# EAGLE schematic CLU (EAGLE 9.6.1)
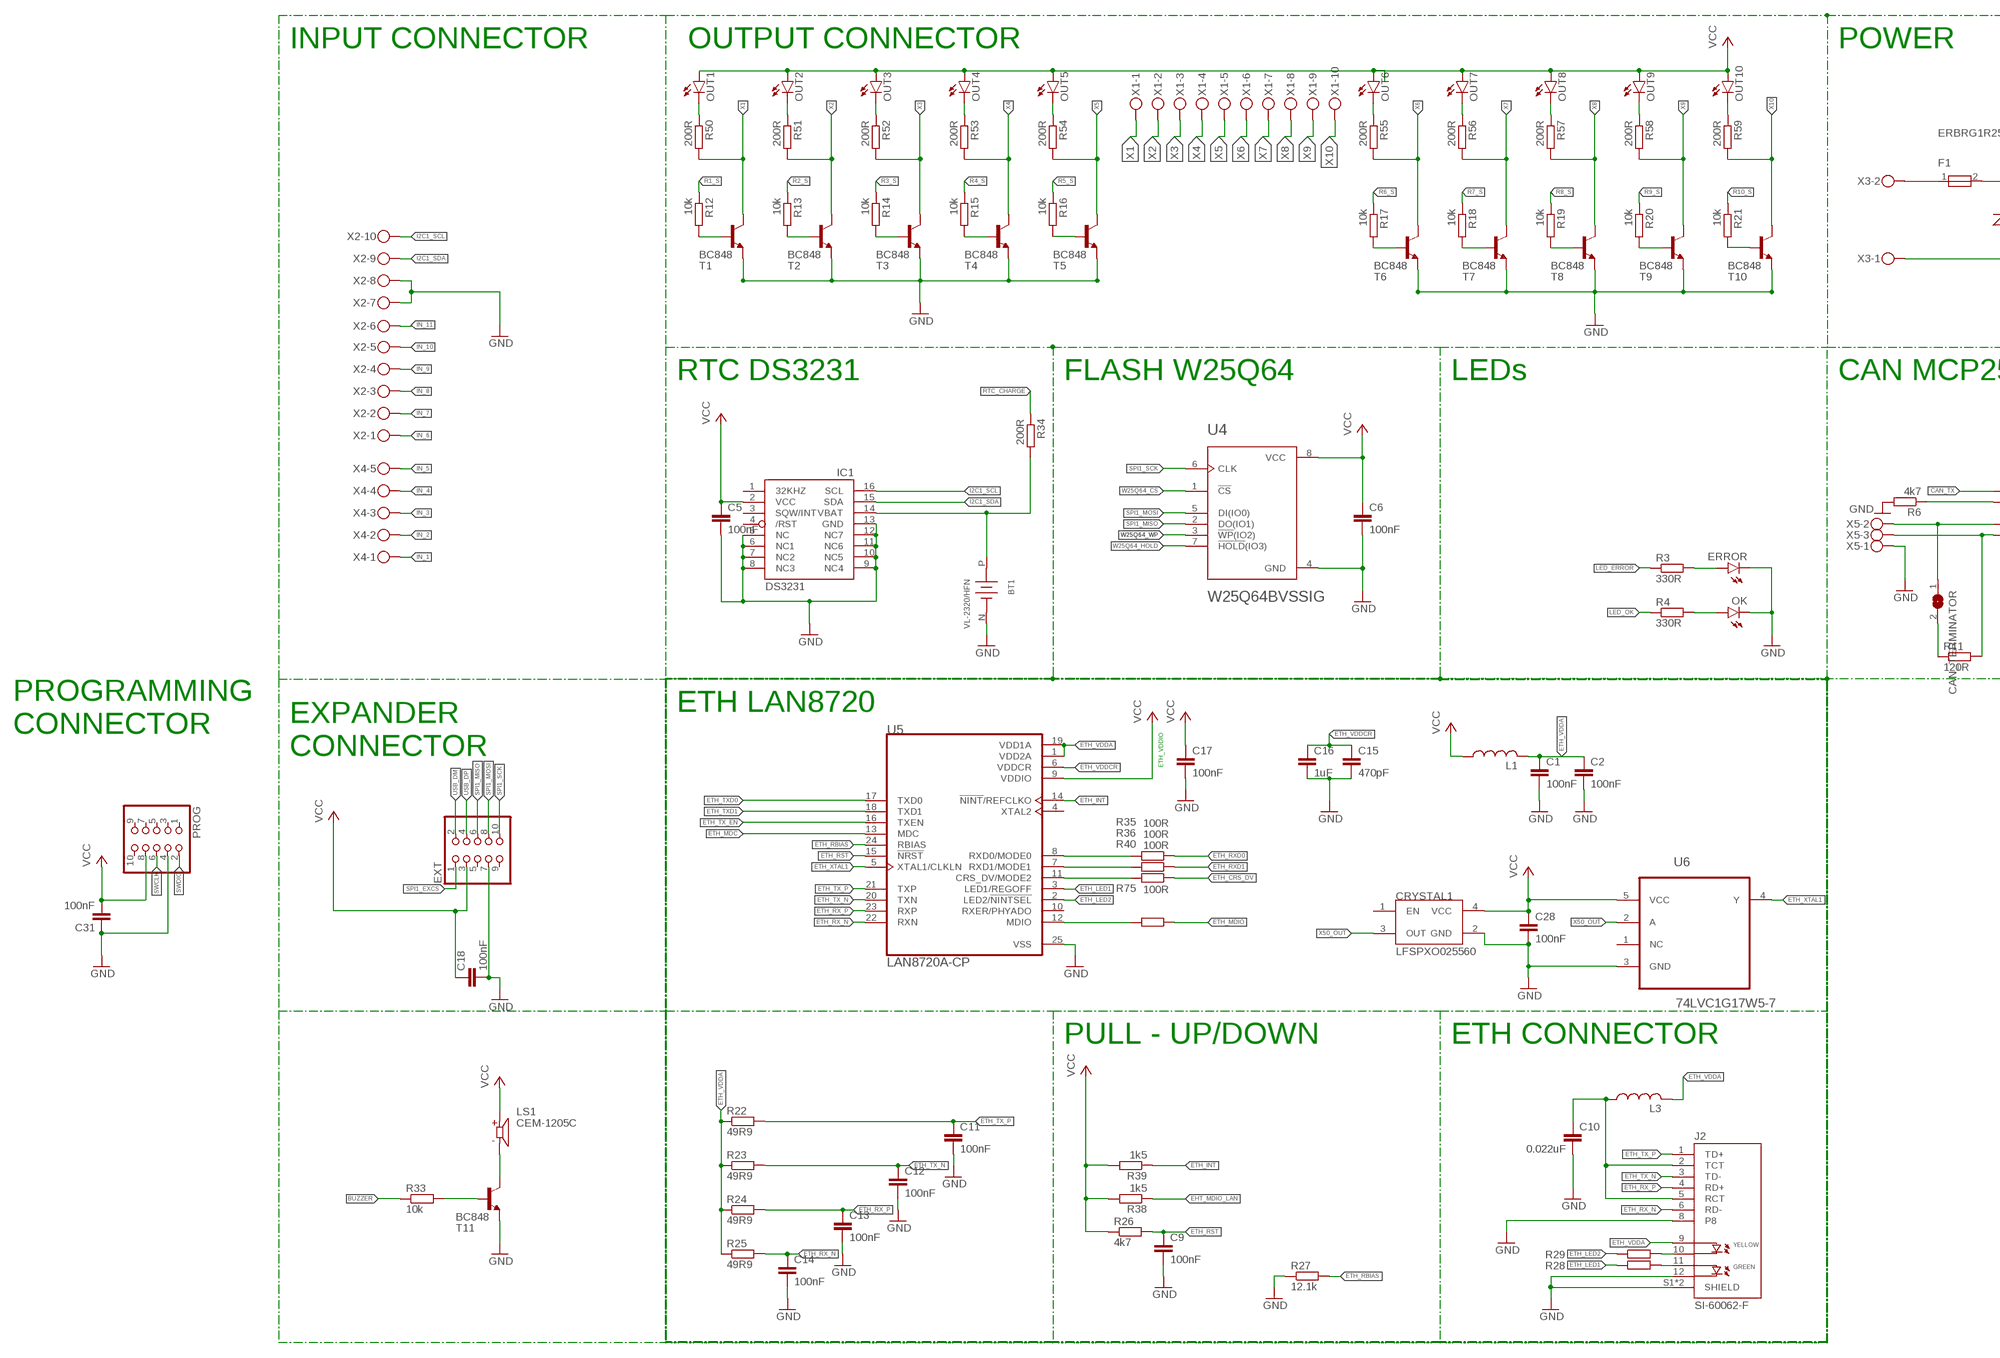
[diagram p0: schematic, sheet 1, part 1 of 2]
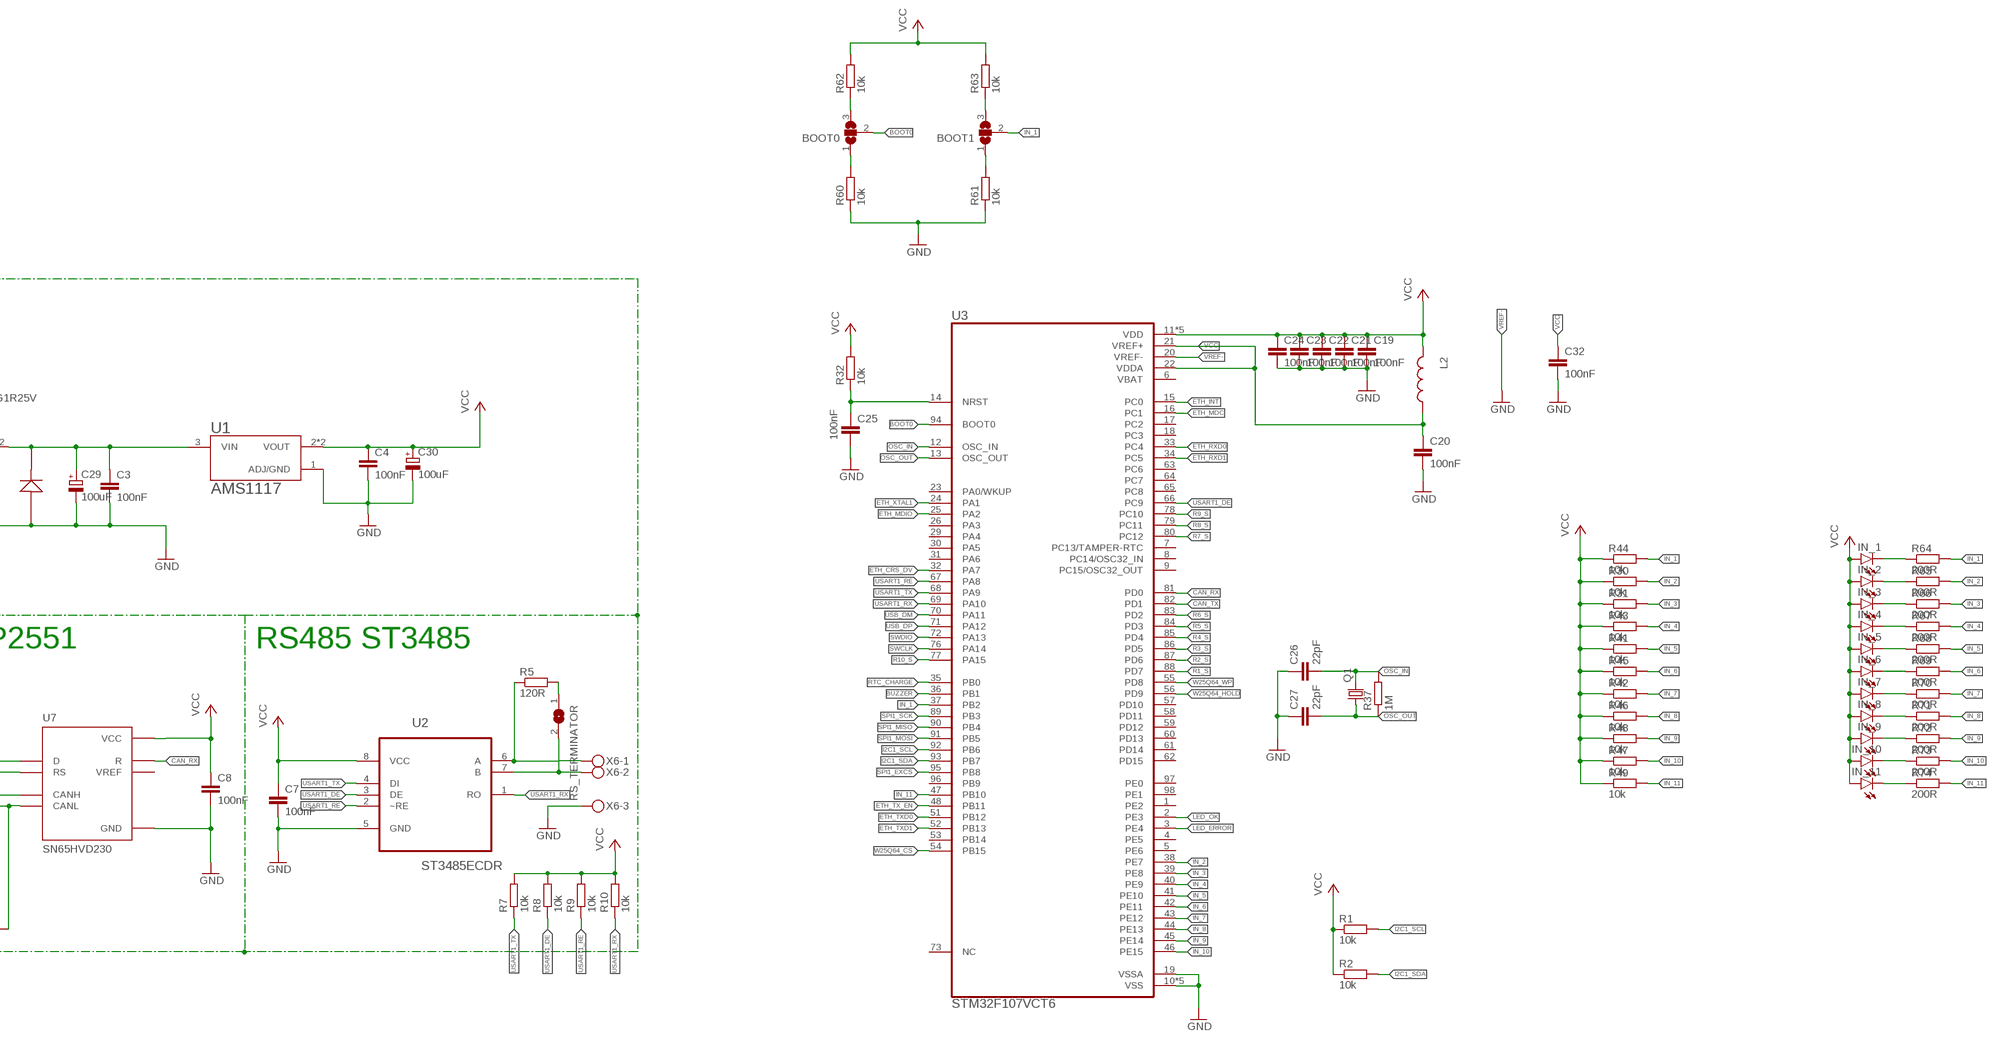
[diagram p1: schematic, sheet 1, part 2 of 2]

## Parts
BOOT0  SJ2W  [SJ_2]
BOOT1  SJ2W  [SJ_2]
BT1  VL-2320/HFN  [BAT_VL-2320/HFN]
C1  100nF  C-EUC0805  [C0805]
C2  100nF  C-EUC0805  [C0805]
C3  100nF  C-EUC0805  [C0805]
C4  100nF  C-EUC0805  [C0805]
C5  100nF  C-EUC0805  [C0805]
C6  100nF  C-EUC0805  [C0805]
C7  100nF  C-EUC0805  [C0805]
C8  100nF  C-EUC0805  [C0805]
C9  100nF  C-EUC0805  [C0805]
C10  0.022uF  C-EUC0805  [C0805]
C11  100nF  C-EUC0805  [C0805]
C12  100nF  C-EUC0805  [C0805]
C13  100nF  C-EUC0805  [C0805]
C14  100nF  C-EUC0805  [C0805]
C15  470pF  C-EUC0805  [C0805]
C16  1uF  C-EUC0805  [C0805]
C17  100nF  C-EUC0805  [C0805]
C18  100nF  C-EUC0805  [C0805]
C19  100nF  C-EUC0805  [C0805]
C20  100nF  C-EUC0805  [C0805]
C21  100nF  C-EUC0805  [C0805]
C22  100nF  C-EUC0805  [C0805]
C23  100nF  C-EUC0805  [C0805]
C24  100nF  C-EUC0805  [C0805]
C25  100nF  C-EUC0805  [C0805]
C26  22pF  C-EUC0805  [C0805]
C27  22pF  C-EUC0805  [C0805]
C28  100nF  C-EUC0805  [C0805]
C29  100uF  CPOL-EUSANYO_SMD_E7  [SANYO-OSCON_SMD_E7]
C30  100uF  CPOL-EUSANYO_SMD_E7  [SANYO-OSCON_SMD_E7]
C31  100nF  C-EUC0805  [C0805]
C32  100nF  C-EUC0805  [C0805]
CAN_TERMINATOR  SJ  [SJ]
CRYSTAL1  LFSPXO025560  [LFSPXO025560-SMD-4]
D1  BYG10D  [DIO_ES1J]
ERROR  LEDCHIPLED_0805  [CHIPLED_0805]
EXT  PINHD-2X5  [2X05]
F1  ERBRG1R25V  [FUSC1206X75N]
IC1  DS3231/SO  [SO16W]
IN_1  LEDCHIPLED_0805  [CHIPLED_0805]
IN_2  LEDCHIPLED_0805  [CHIPLED_0805]
IN_3  LEDCHIPLED_0805  [CHIPLED_0805]
IN_4  LEDCHIPLED_0805  [CHIPLED_0805]
IN_5  LEDCHIPLED_0805  [CHIPLED_0805]
IN_6  LEDCHIPLED_0805  [CHIPLED_0805]
IN_7  LEDCHIPLED_0805  [CHIPLED_0805]
IN_8  LEDCHIPLED_0805  [CHIPLED_0805]
IN_9  LEDCHIPLED_0805  [CHIPLED_0805]
IN_10  LEDCHIPLED_0805  [CHIPLED_0805]
IN_11  LEDCHIPLED_0805  [CHIPLED_0805]
J2  SI-60062-F  [BEL_SI-60062-F]
L1  L-USL2012C  [L2012C]
L2  L-USL2012C  [L2012C]
L3  L-USL2012C  [L2012C]
LS1  CEM-1205C  [CUI_CEM-1205C]
OK  LEDCHIPLED_0805  [CHIPLED_0805]
OUT1  LEDCHIPLED_0805  [CHIPLED_0805]
OUT2  LEDCHIPLED_0805  [CHIPLED_0805]
OUT3  LEDCHIPLED_0805  [CHIPLED_0805]
OUT4  LEDCHIPLED_0805  [CHIPLED_0805]
OUT5  LEDCHIPLED_0805  [CHIPLED_0805]
OUT6  LEDCHIPLED_0805  [CHIPLED_0805]
OUT7  LEDCHIPLED_0805  [CHIPLED_0805]
OUT8  LEDCHIPLED_0805  [CHIPLED_0805]
OUT9  LEDCHIPLED_0805  [CHIPLED_0805]
OUT10  LEDCHIPLED_0805  [CHIPLED_0805]
PROG  PINHD-2X5  [2X05]
Q1  CRYSTALHC49UP  [HC49UP]
R1  10k  R-EU_R0805  [R0805]
R2  10k  R-EU_R0805  [R0805]
R3  330R  R-EU_R0805  [R0805]
R4  330R  R-EU_R0805  [R0805]
R5  120R  R-EU_R0805  [R0805]
R6  4k7  R-EU_R0805  [R0805]
R7  10k  R-EU_R0805  [R0805]
R8  10k  R-EU_R0805  [R0805]
R9  10k  R-EU_R0805  [R0805]
R10  10k  R-EU_R0805  [R0805]
R11  120R  R-EU_R0805  [R0805]
R12  10k  R-EU_R0805  [R0805]
R13  10k  R-EU_R0805  [R0805]
R14  10k  R-EU_R0805  [R0805]
R15  10k  R-EU_R0805  [R0805]
R16  10k  R-EU_R0805  [R0805]
R17  10k  R-EU_R0805  [R0805]
R18  10k  R-EU_R0805  [R0805]
R19  10k  R-EU_R0805  [R0805]
R20  10k  R-EU_R0805  [R0805]
R21  10k  R-EU_R0805  [R0805]
R22  49R9  R-EU_R0805  [R0805]
R23  49R9  R-EU_R0805  [R0805]
R24  49R9  R-EU_R0805  [R0805]
R25  49R9  R-EU_R0805  [R0805]
R26  4k7  R-EU_R0805  [R0805]
R27  12.1k  R-EU_R0805  [R0805]
R28  200R  R-EU_R0805  [R0805]
R29  200R  R-EU_R0805  [R0805]
R30  10k  R-EU_R0805  [R0805]
R31  10k  R-EU_R0805  [R0805]
R32  10k  R-EU_R0805  [R0805]
R33  10k  R-EU_R0805  [R0805]
R34  200R  R-EU_R0805  [R0805]
R35  100R  R-EU_R0805  [R0805]
R36  100R  R-EU_R0805  [R0805]
R37  1M  R-EU_R0805  [R0805]
R38  1k5  R-EU_R0805  [R0805]
R39  1k5  R-EU_R0805  [R0805]
R40  100R  R-EU_R0805  [R0805]
R41  10k  R-EU_R0805  [R0805]
R42  10k  R-EU_R0805  [R0805]
R43  10k  R-EU_R0805  [R0805]
R44  10k  R-EU_R0805  [R0805]
R45  10k  R-EU_R0805  [R0805]
R46  10k  R-EU_R0805  [R0805]
R47  10k  R-EU_R0805  [R0805]
R48  10k  R-EU_R0805  [R0805]
R49  10k  R-EU_R0805  [R0805]
R50  200R  R-EU_R0805  [R0805]
R51  200R  R-EU_R0805  [R0805]
R52  200R  R-EU_R0805  [R0805]
R53  200R  R-EU_R0805  [R0805]
R54  200R  R-EU_R0805  [R0805]
R55  200R  R-EU_R0805  [R0805]
R56  200R  R-EU_R0805  [R0805]
R57  200R  R-EU_R0805  [R0805]
R58  200R  R-EU_R0805  [R0805]
R59  200R  R-EU_R0805  [R0805]
R60  10k  R-EU_R0805  [R0805]
R61  10k  R-EU_R0805  [R0805]
R62  10k  R-EU_R0805  [R0805]
R63  10k  R-EU_R0805  [R0805]
R64  200R  R-EU_R0805  [R0805]
R65  200R  R-EU_R0805  [R0805]
R66  200R  R-EU_R0805  [R0805]
R67  200R  R-EU_R0805  [R0805]
R68  200R  R-EU_R0805  [R0805]
R69  200R  R-EU_R0805  [R0805]
R70  200R  R-EU_R0805  [R0805]
R71  200R  R-EU_R0805  [R0805]
R72  200R  R-EU_R0805  [R0805]
R73  200R  R-EU_R0805  [R0805]
R74  200R  R-EU_R0805  [R0805]
R75  100R  R-EU_R0805  [R0805]
RS_TERMINATOR  SJ  [SJ]
T1  BC848  [SOT23]
T2  BC848  [SOT23]
T3  BC848  [SOT23]
T4  BC848  [SOT23]
T5  BC848  [SOT23]
T6  BC848  [SOT23]
T7  BC848  [SOT23]
T8  BC848  [SOT23]
T9  BC848  [SOT23]
T10  BC848  [SOT23]
T11  BC848  [SOT23]
U1  AMS1117  [SOT229P700X180-4N]
U2  ST3485ECDR  [SOIC127P600X175-8N]
U3  STM32F107VCT6  [QFP50P1600X1600X160-100N]
U4  W25Q64BVSSIG  [SOIC127P790X216-8N]
U5  LAN8720A-CP  [QFN50P400X400X100-25N]
U6  74LVC1G17W5-7  [SOT95P280X145-5N]
U7  SN65HVD230  [SOIC127P599X175-8N]
X1  MKDSN1,5/10-5,08  [MKDSN1,5/10-5,08]
X2  MKDSN1,5/10-5,08  [MKDSN1,5/10-5,08]
X3  MKDSN1,5/2-5,08  [MKDSN1,5/2-5,08]
X4  MKDSN1,5/5-5,08  [MKDSN1,5/5-5,08]
X5  MKDSN1,5/3-5,08  [MKDSN1,5/3-5,08]
X6  MKDSN1,5/3-5,08  [MKDSN1,5/3-5,08]

## Nets
12V: C3.1 C29.+ D1.K(CATHODE) F1.2 U1.3(VIN)
BOOT0: BOOT0.2 U3.94(BOOT0)
BUZZER: R33.1 U3.36(PB1)
CAN_RX: U3.81(PD0) U7.4(R)
CAN_TX: U3.82(PD1) U7.1(D)
EHT_MDIO_LAN: R38.1 R75.2 U5.12(MDIO)
ETH_CRS_DV: R40.1 U3.32(PA7)
ETH_INT: R39.1 U3.15(PC0) U5.14(!NINT!/REFCLKO)
ETH_LED1: R28.1 U5.3(LED1/REGOFF)
ETH_LED2: R29.1 U5.2(LED2/!NINTSEL!)
ETH_MDC: U3.16(PC1) U5.13(MDC)
ETH_MDIO: R75.1 U3.25(PA2)
ETH_RBIAS: R27.2 U5.24(RBIAS)
ETH_RST: C9.1 R26.2 U5.15(!NRST)
ETH_RX_N: C14.1 J2.6(RD-) R25.2 U5.22(RXN)
ETH_RX_P: C13.1 J2.4(RD+) R24.2 U5.23(RXP)
ETH_RXD0: R35.1 U3.33(PC4)
ETH_RXD1: R36.1 U3.34(PC5)
ETH_TX_EN: U3.48(PB11) U5.16(TXEN)
ETH_TX_N: C12.1 J2.3(TD-) R23.2 U5.20(TXN)
ETH_TX_P: C11.1 J2.1(TD+) R22.2 U5.21(TXP)
ETH_TXD0: U3.51(PB12) U5.17(TXD0)
ETH_TXD1: U3.52(PB13) U5.18(TXD1)
ETH_VDDA: C1.1 C2.1 J2.9(YA) L1.2 L3.2 R22.1 R23.1 R24.1 R25.1 U5.1(VDD2A) U5.19(VDD1A)
ETH_VDDCR: C15.1 C16.1 U5.6(VDDCR)
ETH_XTAL1: U3.24(PA1) U5.5(XTAL1/CLKLN) U6.4(Y)
GND: BT1.N C1.2 C2.2 C3.2 C4.2 C5.2 C6.2 C7.2 C8.2 C9.2 C10.2 C11.2 C12.2 C13.2 C14.2 C15.2 C16.2 C17.2 C18.2 C19.2 C20.2 C21.2 C22.2 C23.2 C24.2 C25.2 C26.1 C27.1 C28.2 C29.- C30.- C31.1 C32.2 CRYSTAL1.2(GND) D1.A(ANODE) ERROR.C EXT.7 IC1.5(NC) IC1.6(NC1) IC1.7(NC2) IC1.8(NC3) IC1.9(NC4) IC1.10(NC5) IC1.11(NC6) IC1.12(NC7) IC1.13(GND) J2.8 J2.12(GK) J2.S1(SHIELD) J2.S2(SHIELD) OK.C PROG.4 R6.2 R27.1 R60.1 R61.1 T1.2(E) T2.2(E) T3.2(E) T4.2(E) T5.2(E) T6.2(E) T7.2(E) T8.2(E) T9.2(E) T10.2(E) T11.2(E) U1.1(ADJ/GND) U2.5(GND) U3.10(VSS) U3.19(VSSA) U3.27(VSS) U3.49(VSS) U3.74(VSS) U3.99(VSS) U4.4(GND) U5.25(VSS) U6.3(GND) U7.2(GND) X2.7 X2.8 X3.1 X5.1 X6.3
I2C1_SCL: IC1.16(SCL) R1.2 U3.92(PB6) X2.10
I2C1_SDA: IC1.15(SDA) R2.2 U3.93(PB7) X2.9
IN_1: BOOT1.2 R44.2 R64.2 U3.37(PB2) X4.1
IN_2: R30.2 R65.2 U3.38(PE7) X4.2
IN_3: R31.2 R66.2 U3.39(PE8) X4.3
IN_4: R43.2 R67.2 U3.40(PE9) X4.4
IN_5: R41.2 R68.2 U3.41(PE10) X4.5
IN_6: R45.2 R69.2 U3.42(PE11) X2.1
IN_7: R42.2 R70.2 U3.43(PE12) X2.2
IN_8: R46.2 R71.2 U3.44(PE13) X2.3
IN_9: R48.2 R72.2 U3.45(PE14) X2.4
IN_10: R47.2 R73.2 U3.46(PE15) X2.5
IN_11: R49.2 R74.2 U3.47(PB10) X2.6
LED_ERROR: R3.1 U3.3(PE4)
LED_OK: R4.1 U3.2(PE3)
N$1: CAN_TERMINATOR.1 U7.7(CANH) X5.2
N$2: R11.2 U7.6(CANL) X5.3
N$3: R5.1 U2.6(A) X6.1
N$4: RS_TERMINATOR.2 U2.7(B) X6.2
N$5: BT1.P IC1.14(VBAT) R34.2
N$6: R17.2 T6.1(B)
N$8: R18.2 T7.1(B)
N$9: R19.2 T8.1(B)
N$10: R20.2 T9.1(B)
N$11: OUT1.C R50.1
N$12: R21.2 T10.1(B)
N$13: R5.2 RS_TERMINATOR.1
N$14: R6.1 U7.8(RS)
N$15: CAN_TERMINATOR.2 R11.1
N$16: R12.2 T1.1(B)
N$17: R13.2 T2.1(B)
N$18: OK.A R4.2
N$19: ERROR.A R3.2
N$20: R14.2 T3.1(B)
N$21: R15.2 T4.1(B)
N$22: R16.2 T5.1(B)
N$23: OUT2.C R51.1
N$24: OUT3.C R52.1
N$25: OUT4.C R53.1
N$26: OUT5.C R54.1
N$27: C10.1 J2.2(TCT) J2.5(RCT) L3.1
N$28: OUT6.C R55.1
N$29: OUT7.C R56.1
N$30: J2.11(GA) R28.2
N$31: J2.10(YK) R29.2
N$32: R36.2 U5.7(RXD1/MODE1)
N$33: R35.2 U5.8(RXD0/MODE0)
N$34: LS1.N T11.3(C)
N$35: R33.2 T11.1(B)
N$36: OUT8.C R57.1
N$37: R40.2 U5.11(CRS_DV/MODE2)
N$38: OUT9.C R58.1
N$39: OUT10.C R59.1
N$40: IN_10.C R73.1
N$41: IN_1.C R64.1
N$42: BOOT1.1 R61.2
N$43: BOOT0.1 R60.2
N$44: BOOT0.3 R62.1
N$45: BOOT1.3 R63.1
N$46: IN_2.C R65.1
N$47: IN_3.C R66.1
N$48: IN_4.C R67.1
N$49: IN_5.C R68.1
N$50: IN_6.C R69.1
N$51: IN_7.C R70.1
N$52: IN_8.C R71.1
N$53: IN_9.C R72.1
N$54: IN_11.C R74.1
OSC_IN: C26.2 Q1.2 R37.2 U3.12(OSC_IN)
OSC_OUT: C27.2 Q1.1 R37.1 U3.13(OSC_OUT)
POWER_IN: F1.1 X3.2
R1_S: R12.1 U3.88(PD7)
R2_S: R13.1 U3.87(PD6)
R3_S: R14.1 U3.86(PD5)
R4_S: R15.1 U3.85(PD4)
R5_S: R16.1 U3.84(PD3)
R6_S: R17.1 U3.83(PD2)
R7_S: R18.1 U3.80(PC12)
R8_S: R19.1 U3.79(PC11)
R9_S: R20.1 U3.78(PC10)
R10_S: R21.1 U3.77(PA15)
RST: C25.1 R32.1 U3.14(NRST)
RTC_CHARGE: R34.1 U3.35(PB0)
SPI1_EXCS: EXT.1 U3.95(PB8)
SPI1_MISO: EXT.6 U3.90(PB4) U4.2(DO(IO1))
SPI1_MOSI: EXT.8 U3.91(PB5) U4.5(DI(IO0))
SPI1_SCK: EXT.10 U3.89(PB3) U4.6(CLK)
SWCLK: PROG.6 U3.76(PA14)
SWDIO: PROG.2 U3.72(PA13)
USART1_DE: R8.1 U2.3(DE) U3.66(PC9)
USART1_RE: R9.1 U2.2(~RE) U3.67(PA8)
USART1_RX: R10.1 U2.1(RO) U3.69(PA10)
USART1_TX: R7.1 U2.4(DI) U3.68(PA9)
USB_DM: EXT.2 U3.70(PA11)
USB_DP: EXT.4 U3.71(PA12)
VCC: C4.1 C5.1 C6.1 C7.1 C8.1 C17.1 C18.1 C19.1 C20.1 C21.1 C22.1 C23.1 C24.1 C28.1 C30.+ C31.2 C32.1 CRYSTAL1.4(VCC) EXT.3 IC1.2(VCC) IN_1.A IN_2.A IN_3.A IN_4.A IN_5.A IN_6.A IN_7.A IN_8.A IN_9.A IN_10.A IN_11.A L1.1 L2.1 L2.2 LS1.P OUT1.A OUT2.A OUT3.A OUT4.A OUT5.A OUT6.A OUT7.A OUT8.A OUT9.A OUT10.A PROG.8 R1.1 R2.1 R7.2 R8.2 R9.2 R10.2 R26.1 R30.1 R31.1 R32.2 R38.2 R39.2 R41.1 R42.1 R43.1 R44.1 R45.1 R46.1 R47.1 R48.1 R49.1 R62.2 R63.2 U1.2(VOUT) U1.4(VOUT) U2.8(VCC) U3.11(VDD) U3.21(VREF+) U3.22(VDDA) U3.28(VDD) U3.50(VDD) U3.75(VDD) U3.100(VDD) U4.8(VCC) U5.9(VDDIO) U6.5(VCC) U7.3(VCC)
VREF-: U3.20(VREF-) ; supply symbol labelled GND
W25Q64_CS: U3.54(PB15) U4.1(!CS)
W25Q64_HOLD: U3.56(PD9) U4.7(!HOLD!(IO3))
W25Q64_WP: U3.55(PD8) U4.3(!WP!(IO2))
X1: R50.2 T1.3(C) X1.1
X2: R51.2 T2.3(C) X1.2
X3: R52.2 T3.3(C) X1.3
X4: R53.2 T4.3(C) X1.4
X5: R54.2 T5.3(C) X1.5
X6: R55.2 T6.3(C) X1.6
X7: R56.2 T7.3(C) X1.7
X8: R57.2 T8.3(C) X1.8
X9: R58.2 T9.3(C) X1.9
X10: R59.2 T10.3(C) X1.10
X50_OUT: CRYSTAL1.3(OUT) U6.2(A)
Unconnected: CRYSTAL1.1(EN) EXT.5 EXT.9 IC1.1(32KHZ) IC1.3(SQW/INT) IC1.4(/RST) PROG.1 PROG.3 PROG.5 PROG.7 PROG.9 PROG.10 U3.1(PE2) U3.4(PE5) U3.5(PE6) U3.7(PC13/TAMPER-RTC) U3.8(PC14/OSC32_IN) U3.9(PC15/OSC32_OUT) U3.17(PC2) U3.18(PC3) U3.23(PA0/WKUP) U3.26(PA3) U3.29(PA4) U3.30(PA5) U3.31(PA6) U3.53(PB14) U3.57(PD10) U3.58(PD11) U3.59(PD12) U3.60(PD13) U3.61(PD14) U3.62(PD15) U3.63(PC6) U3.64(PC7) U3.65(PC8) U3.73(NC) U3.96(PB9) U3.97(PE0) U3.98(PE1) U5.4(XTAL2) U5.10(RXER/PHYADO) U6.1(NC) U7.5(VREF)

## Notes on the sheet
- INPUT CONNECTOR | OUTPUT CONNECTOR | POWER
- RTC DS3231 | FLASH W25Q64 | LEDs | CAN MCP2551 | RS485 ST3485
- ETH LAN8720
- PROGRAMMING
  CONNECTOR
- EXPANDER
  CONNECTOR
- ETH_VDDIO
- PULL - UP/DOWN | ETH CONNECTOR

## Power pins joined to a net without a drawn wire
VBAT: U3.6(VBAT)

## Library data of the parts
BOOT0 BOOT1 = jumper:SJ2W: SMD solder JUMPER
BT1 = VL-2320_HFN:VL-2320/HFN: Battery; Lithium; Coin Cell; 3V; 30 MAH; 2 Pin Horizontal Leads; Rechargeable Check availability <https://pricing.snapeda.com/parts/VL-2320/HFN/Panasonic%20-/view-part?ref=eda>; AVAILABILITY: In Stock; DESCRIPTION: Coin, 23.0mm 3 V Lithium Battery Rechargeable (Secondary) 30mAh; MF: Panasonic -; MP: VL-2320/HFN; PACKAGE: QFP-208 Panasonic; PRICE: None; PURCHASE-URL: https://pricing.snapeda.com/search/part/VL-2320/HFN/?ref=eda
C1-C28 C31 C32 = rcl:C-EU: CAPACITOR, European symbol; SPICEPREFIX: C
C29 C30 = rcl:CPOL-EU: POLARIZED CAPACITOR, European symbol; SPICEPREFIX: C
CAN_TERMINATOR RS_TERMINATOR = jumper:SJ: SMD solder JUMPER
CRYSTAL1 = LF SPXO025560:LFSPXO025560: SMD Crystal 50MHz; AVAILABILITY: In Stock; DESCRIPTION: 16 MHz ±10ppm Crystal 9pF 60 Ohms 4-SMD, No Lead; MF: EPSON; MP: TSX-3225 16.0000MF18X-AC3; PACKAGE: SMD-4 EPSON; PRICE: None; PURCHASE-URL: https://pricing.snapeda.com/search/part/TSX-3225 16.0000MF18X-AC3/?ref=eda
D1 = BYG10D:BYG10D
ERROR IN_1-IN_11 OK OUT1-OUT10 = led:LED: LED OSRAM: - CHIPLED LG R971, LG N971, LY N971, LG Q971, LY Q971, LO R971, LY R971 LH N974, LH R974 LS Q976, LO Q976, LY Q976 LO Q996 - Hyper CHIPLED LW Q18S LB Q993, LB Q99A, LB R99A - SideLED LS A670, LO A670, LY A670, LG A670, LP A670 LB A673, LV A673, LT A673, LW A673 LH A674 LY A675 LS A676, LA A676, LO A676, LY A676, LW A676 LS A679, LY A679, LG A679 - Hyper Micro SIDELED® LS Y876, LA Y876, LO Y876, LY Y876 LT Y87S - SmartLED LW L88C, LW L88S LB L89C, LB L89S, LG L890 LS L89K, LO L89K, LY L89K LS L896, LA L896, LO L896, LY L896 - TOPLED LS T670, LO T670, LY T670, LG T670, LP T670 LSG T670, LSP T670, LSY T670, LOP T670, LYG T670 LG T671, LOG T671, LSG T671 LB T673, LV T673, LT T673, LW T673 LH T674 LS T676, LA T676, LO T676, LY T676, LB T676, LH T676, LSB T676, LW T676 LB T67C, LV T67C, LT T67C, LS T67K, LO T67K, LY T67K, LW E67C LS E67B, LA E67B, LO E67B, LY E67B, LB E67C, LV E67C, LT E67C LW T67C LS T679, LY T679, LG T679 LS T770, LO T770, LY T770, LG T770, LP T770 LB T773, LV T773, LT T773, LW T773 LH T774 LS E675, LA E675, LY E675, LS T675 LS T776, LA T776, LO T776, LY T776, LB T776 LHGB T686 LT T68C, LB T68C - Hyper Mini TOPLED® LB M676 - Mini TOPLED Santana® LG M470 LS M47K, LO M47K, LY M47K Source: http://www.osram.convergy.de LUXEON: - LUMILED® LXK2-PW12-R00, LXK2-PW12-S00, LXK2-PW14-U00, LXK2-PW14-V00 LXK2-PM12-R00, LXK2-PM12-S00, LXK2-PM14-U00 LXK2-PE12-Q00, LXK2-PE12-R00, LXK2-PE12-S00, LXK2-PE14-T00, LXK2-PE14-U00 LXK2-PB12-K00, LXK2-PB12-L00, LXK2-PB12-M00, LXK2-PB14-N00, LXK2-PB14-P00, LXK2-PB14-Q00 LXK2-PR12-L00, LXK2-PR12-M00, LXK2-PR14-Q00, LXK2-PR14-R00 LXK2-PD12-Q00, LXK2-PD12-R00, LXK2-PD12-S00 LXK2-PH12-R00, LXK2-PH12-S00 LXK2-PL12-P00, LXK2-PL12-Q00, LXK2-PL12-R00 Source: www.luxeon.com KINGBRIGHT: KA-3528ASYC Source: www.kingbright.com
EXT PROG = pinhead:PINHD-2X5: PIN HEADER
F1 = ERBRG1R25V:ERBRG1R25V: Micro Chip Fuse, Size [L×W] (EIA) (mm): 3.2×1.6 (EIA:1206), Rated Current (A): 1.25, Internal R [at 25℃ max.] (mΩ): 175, Rated Voltage (Open Circuit Voltage) [DC] (V): 63, Interrupting Rating (A): 50, Category Temp. Range (°C): -40 to +125 Check availability <https://pricing.snapeda.com/parts/ERBRG1R25V/Panasonic/view-part?ref=eda>; AVAILABILITY: In Stock; DESCRIPTION: Micro Chip Fuse, Size [L×W] (EIA) (mm): 3.2×1.6 (EIA:1206), Rated Current (A): 1.25, Internal R [at 25℃ max.] (mΩ): 175, Rated Voltage (Open Circuit Voltage) [DC] (V): 63, Interrupting Rating (A): 50, Category Temp. Range (°C): -40 to +125; MF: Panasonic; MP: ERBRG1R25V; PACKAGE: 1206 Panasonic Electronic; PRICE: None; PURCHASE-URL: https://pricing.snapeda.com/search/part/ERBRG1R25V/?ref=eda
IC1 = DS3231:DS3231: Check availability <https://pricing.snapeda.com/parts/DS3231/Maxim%20Integrated/view-part?ref=eda>; AVAILABILITY: In Stock; DESCRIPTION: Real Time Clock (RTC) IC Clock/Calendar - I²C, 2-Wire Serial 8-SOIC (0.154, 3.90mm Width); MF: Maxim Integrated; MP: DS3231; PACKAGE: SOIC-16 Maxim Integrated; PRICE: None; PURCHASE-URL: https://pricing.snapeda.com/search/part/DS3231/?ref=eda
J2 = SI-60062-F:SI-60062-F: 1 Port RJ45 Magjack Connector Through Hole 10/100 Base-T, AutoMDIX Check availability <https://pricing.snapeda.com/parts/SI-60062-F/Bel-Stewart/view-part?ref=eda>; AVAILABILITY: In Stock; DESCRIPTION: 1 Port RJ45Through Hole 10/100 Base-T, AutoMDIX; MF: Bel-Stewart; MP: SI-60062-F; PACKAGE: None; PRICE: None; PURCHASE-URL: https://pricing.snapeda.com/search/part/SI-60062-F/?ref=eda
L1-L3 = rcl:L-US: INDUCTOR, American symbol; SPICEPREFIX: L
LS1 = CEM-1205C:CEM-1205C: 12 mm, 5 V, 85 dB, Through Hole, Sealed, Driving Circuit, Magnetic Audio Indicator Buzzer Check availability <https://pricing.snapeda.com/parts/CEM-1205C/CUI%20Devices/view-part?ref=eda>; AVAILABILITY: In Stock; CUI_PURCHASE_URL: https://www.cuidevices.com/product/audio/buzzers/audio-indicators/cem-1205c?utm_source=snapeda.com&utm_medium=referral&utm_campaign=snapedaBOM; DESCRIPTION: 12 mm, 5 V, 85 dB, Through Hole, Sealed, Driving Circuit, Magnetic Audio Indicator Buzzer; MF: CUI Devices; MP: CEM-1205C; PACKAGE: None; PRICE: None; PURCHASE-URL: https://pricing.snapeda.com/search/part/CEM-1205C/?ref=eda
Q1 = crystal:CRYSTAL: CRYSTAL; OC_FARNELL: unknown; OC_NEWARK: unknown
R1-R75 = rcl:R-EU_: RESISTOR, European symbol; SPICEPREFIX: R
T1-T11 = transistor:BC848: NPN TRANSISTOR
U1 = AMS1117:AMS1117: Sot223/Pkg 1-Amp 5-Volt Low Drop Out Voltage Regulatator; AVAILABILITY: Unavailable; DESCRIPTION: UNO PLUS Arduino R3 Shield, Xbee Arduino IDE Wheeled Robotics Kit; MF: Seeed Technology; MP: AMS1117; PACKAGE: SOT-223 Seeed Technology; PRICE: None
U2 = ST3485ECDR:ST3485ECDR: RS-485/RS-422 transceiver Check availability <https://pricing.snapeda.com/parts/ST3485ECDR/STMicroelectronics/view-part?ref=eda>; AVAILABILITY: In Stock; DESCRIPTION: 1/1 Transceiver Half RS422, RS485 8-SOIC; MF: STMicroelectronics; MP: ST3485ECDR; PACKAGE: SO-8 STMicroelectronics; PRICE: None; PURCHASE-URL: https://pricing.snapeda.com/search/part/ST3485ECDR/?ref=eda
U3 = STM32F107VCT6:STM32F107VCT6: IC MCU 32BIT 256KB FLASH 100LQFP Check availability <https://pricing.snapeda.com/parts/STM32F107VCT6/STMicroelectronics/view-part?ref=eda>; AVAILABILITY: In Stock; DESCRIPTION: ARM® Cortex®-M3 STM32F1 Microcontroller IC 32-Bit 72MHz 256KB (256K x 8) FLASH 100-LQFP (14x14); MF: STMicroelectronics; MP: STM32F107VCT6; PACKAGE: LQFP-100 STMicroelectronics; PRICE: None; PURCHASE-URL: https://pricing.snapeda.com/search/part/STM32F107VCT6/?ref=eda
U4 = W25Q64BVSSIG:W25Q64BVSSIG: IC FLASH 64MBIT 80MHZ 8SOIC Check availability <https://pricing.snapeda.com/parts/W25Q64BVSSIG/Winbond%20Electronics/view-part?ref=eda>; AVAILABILITY: In Stock; DESCRIPTION: FLASH - NOR Memory IC 64Mb (8M x 8) SPI 80 MHz 8-SOIC; MF: Winbond Electronics; MP: W25Q64BVSSIG; PACKAGE: SOIC-8 Winbond; PRICE: None; PURCHASE-URL: https://pricing.snapeda.com/search/part/W25Q64BVSSIG/?ref=eda
U5 = LAN8720A-CP:LAN8720A-CP: LAN8720A Series 3.3 V RMII 10/100 Ethernet Transceiver Surface Mount - QFN-24 Check availability <https://pricing.snapeda.com/parts/LAN8720A-CP/Microchip%20Technology/view-part?ref=eda>; AVAILABILITY: In Stock; DESCRIPTION: PHY 1-CH 10Mbps/100Mbps 2.5V/3.3V 24-Pin VQFN EP Tray; MF: Microchip Technology; MP: LAN8720A-CP; PACKAGE: VFQFN-24 Microchip Technology; PRICE: None; PURCHASE-URL: https://pricing.snapeda.com/search/part/LAN8720A-CP/?ref=eda
U6 = 74LVC1G17W5-7:74LVC1G17W5-7: SCHMITT-TRIGGER INVERETER Check availability <https://pricing.snapeda.com/parts/74LVC1G17W5-7/Diodes%20Inc./view-part?ref=eda>; AVAILABILITY: In Stock; DESCRIPTION: Buffer, Non-Inverting 1 Element 1 Bit per Element Push-Pull Output SOT-25; MF: Diodes Inc.; MP: 74LVC1G17W5-7; PACKAGE: SOT-753 Diodes Inc.; PRICE: None; PURCHASE-URL: https://pricing.snapeda.com/search/part/74LVC1G17W5-7/?ref=eda
U7 = SN65HVD230:SN65HVD230: the sn65hvd230 sn65hvd231 and sn65hvd232 controller area network (can) transceivers are designed for use with the tex... Check availability <https://pricing.snapeda.com/parts/SN65HVD230/Texas%20Instruments/view-part?ref=eda>; AVAILABILITY: In Stock; DESCRIPTION: 1/1 Transceiver Half CANbus 8-SOIC; MF: Texas Instruments; MP: SN65HVD230; PACKAGE: SOIC-8 Texas Instruments; PRICE: None; PURCHASE-URL: https://pricing.snapeda.com/search/part/SN65HVD230/?ref=eda
X1 X2 = con-phoenix-508:MKDSN1,5/10-5,08: MKDSN 1,5/10-5,08 Printklemme Nennstrom: 13,5 A Nennspannung: 250 V Rastermaß: 5,08 mm Polzahl: 10 Anschlussart: Schraubanschluss Montage: Löten Anschlussrichtung Leiter/Platine: 0 ° Artikelnummer: 1729209 Source: http://eshop.phoenixcontact.com .. 1729209.pdf
X3 = con-phoenix-508:MKDSN1,5/2-5,08: MKDSN 1,5/ 2-5,08 Printklemme Nennstrom: 13,5 A Nennspannung: 250 V Rastermaß: 5,08 mm Polzahl: 2 Anschlussart: Schraubanschluss Montage: Löten Anschlussrichtung Leiter/Platine: 0 ° Artikelnummer: 1729128 Source: http://eshop.phoenixcontact.com .. 1729128.pdf
X4 = con-phoenix-508:MKDSN1,5/5-5,08: MKDSN 1,5/ 5-5,08 Printklemme Nennstrom: 13,5 A Nennspannung: 250 V Rastermaß: 5,08 mm Polzahl: 5 Anschlussart: Schraubanschluss Montage: Löten Anschlussrichtung Leiter/Platine: 0 ° Artikelnummer: 1729157 Source: http://eshop.phoenixcontact.com .. 1729157.pdf
X5 X6 = con-phoenix-508:MKDSN1,5/3-5,08: MKDSN 1,5/ 3-5,08 Printklemme Nennstrom: 13,5 A Nennspannung: 250 V Rastermaß: 5,08 mm Polzahl: 3 Anschlussart: Schraubanschluss Montage: Löten Anschlussrichtung Leiter/Platine: 0 ° Artikelnummer: 1729131 Source: http://eshop.phoenixcontact.com .. 1729131.pdf

## Net classes
0 default: width 0.152 mm, drill 0.35 mm, clearance 0.152 mm
1 SIGNALS: width 0.508 mm, drill 0.35 mm, clearance 0.152 mm
2 GND: width 0.889 mm, clearance 0.152 mm
3 DIFFERENTIAL: clearance 0.762 mm